# Altium schematic sheet shematic.SchDoc
size A; SheetNumber: 1; SheetTotal: 1; SPICEModelCacheWUGLWVEZ: <root> / <DocumentId>WUGLWVEZ</DocumentId> / <CacheFrame Number="0"> / <Model Name="3mm_151031ss04000" Kind="CKT"> / <Text>************************************************** / * Manufacturer:           Wurth Elektronik / * Kinds:                  THT Mono-color Round Color / * Matchcode:              WL-TMRC / * Library Type:           LTspice / * Version:                rev22a / * Created/modified by:    Ella / * Date and Time:          2022-02-23 / * Team:                   eiSos EDA Service / * Contact:                libraries@we-online.com / ************************************************** / * Copyright(C) 2022 WÃ¼rth Elektronik eiSos GmbH &amp; Co. KG / * All Rights Reserved. / ************************************************** / * Disclaimer: While WÃ¼rth Elektronik eiSos has made every reasonable effort to ensure the accuracy / * of the simulation models provided, WÃ¼rth Elektronik eiSos does not guarantee the exemption of error on / * the simulation models, nor does WÃ¼rth Elektronik eiSos guarantee that the simulation model is current. / * WÃ¼rth Elektronik eiSos reserves the right to make any adjustments at any time without notice. / * WÃ¼rth Elektronik eiSos expressly disclaims all implied warranties regarding this simulation model. / ************************************************** / .subckt 3mm_151031SS04000  1  2 / D1 1 2 TMRC / .MODEL TMRC D / + IS=10.010E-21 / + N=1.8860 / + RS=1.0000E-6 / + IKF=1.0000E3 / + CJO=1.0000E-12 / + M=.3333 / + VJ=.75 / + BV=5 / + IBV=10.00E-6 / + TT=5.0000E-9 / .ends</Text> / </Model> / <Model Name="3mm_151031vs06000" Kind="CKT"> / <Text>****** / .subckt 3mm_151031VS06000  1  2 / D1 1 2 TMRC / .MODEL TMRC D / + IS=10.010E-21 / + N=1.9531 / + RS=1.0000E-6 / + IKF=4.1566E-3 / + CJO=1.0000E-12 / + M=.3333 / + VJ=.75 / + BV=5 / + IBV=10.00E-6 / + TT=5.0000E-9 / .ends</Text> / </Model> / </CacheFrame> / </root>
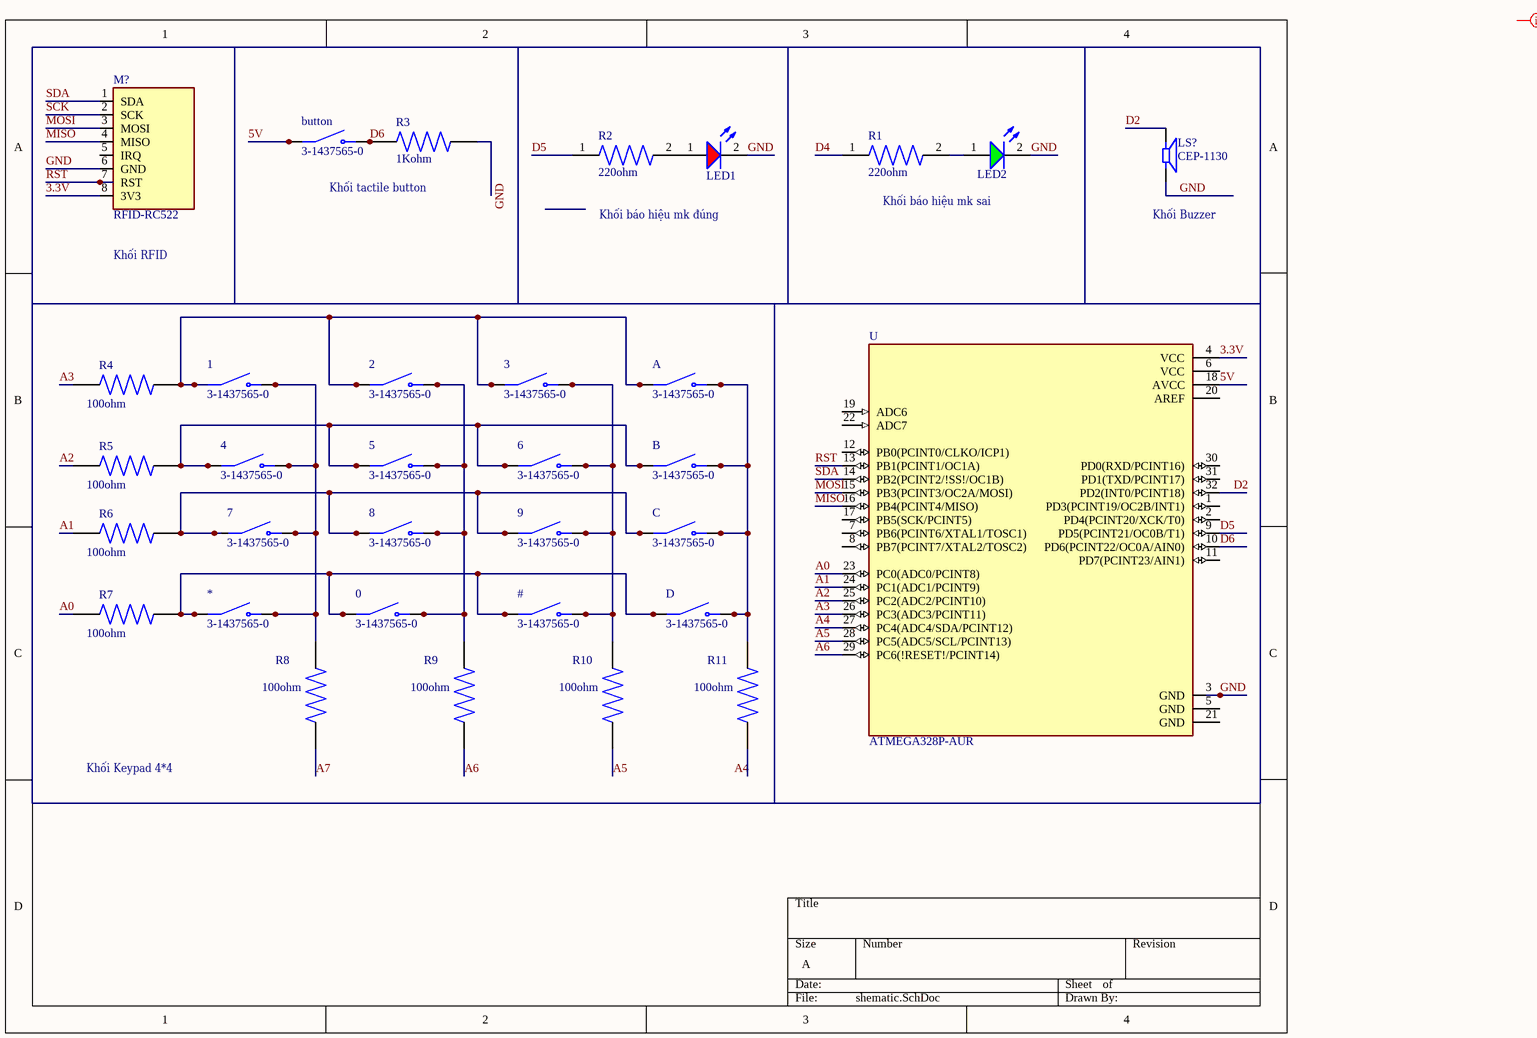
[diagram p0: shematic.SchDoc]

## Parts
0  3-1437565-0  [SW_3-1437565-0]
1  3-1437565-0  [SW_3-1437565-0]
2  3-1437565-0  [SW_3-1437565-0]
3  3-1437565-0  [SW_3-1437565-0]
4  3-1437565-0  [SW_3-1437565-0]
5  3-1437565-0  [SW_3-1437565-0]
6  3-1437565-0  [SW_3-1437565-0]
7  3-1437565-0  [SW_3-1437565-0]
8  3-1437565-0  [SW_3-1437565-0]
9  3-1437565-0  [SW_3-1437565-0]
#  3-1437565-0  [SW_3-1437565-0]
*  3-1437565-0  [SW_3-1437565-0]
A  3-1437565-0  [SW_3-1437565-0]
B  3-1437565-0  [SW_3-1437565-0]
button  3-1437565-0  [SW_3-1437565-0]
C  3-1437565-0  [SW_3-1437565-0]
D  3-1437565-0  [SW_3-1437565-0]
LED1  Super Red, 2V, 40°  [WL-TMRC_D3.95H5.3]  (value not drawn)
LED2  Bright Green, 2.2V, 60°  [WL-TMRC_D3.95H5.3]  (value not drawn)
LS?  CEP-1130  [CUI_CEP-1130]
M?  RFID-RC522  [RFID-RC522]
R1  220ohm  [RESAD700W45L350D185]
R2  220ohm  [RESAD700W45L350D185]
R3  1Kohm  [RESC2012X65N]
R4  100ohm  [RESC1005X35N]
R5  100ohm  [RESC1005X35N]
R6  100ohm  [RESC1005X35N]
R7  100ohm  [RESC1005X35N]
R8  100ohm  [RESC1005X35N]
R9  100ohm  [RESC1005X35N]
R10  100ohm  [RESC1005X35N]
R11  100ohm  [RESC1005X35N]
U  ATMEGA328P-AUR  [QFP80P900X900X120-32N]

## Nets
3.3V: M?.8(3V3) U.4(VCC)
5V: button.1(COM) button.2(COM) U.18(AVCC)
A0: R7.1 U.23(PC0(ADC0/PCINT8))
A1: R6.1 U.24(PC1(ADC1/PCINT9))
A2: R5.1 U.25(PC2(ADC2/PCINT10))
A3: R4.1 U.26(PC3(ADC3/PCINT11))
A4: U.27(PC4(ADC4/SDA/PCINT12))
A5: R10.2 U.28(PC5(ADC5/SCL/PCINT13))
A6: R9.2 U.29(PC6(!RESET!/PCINT14))
A7: R8.1
D2: LS?.1 U.32(PD2(INT0/PCINT18))
D4: R1.1
D5: R2.1 U.9(PD5(PCINT21/OC0B/T1))
D6: button.3(NO) button.4(NO) R3.1 U.10(PD6(PCINT22/OC0A/AIN0))
GND: LED1.2(K) LED2.2(K) LS?.2 M?.6(GND) R3.2 U.3(GND)
MISO: M?.4(MISO) U.16(PB4(PCINT4/MISO))
MOSI: M?.3(MOSI) U.15(PB3(PCINT3/OC2A/MOSI))
RST: M?.7(RST) U.13(PB1(PCINT1/OC1A))
SCK: M?.2(SCK)
SDA: M?.1(SDA) U.14(PB2(PCINT2/!SS!/OC1B))
Net0_1: 0.1(COM) 0.2(COM) #.1(COM) #.2(COM) *.1(COM) *.2(COM) D.1(COM) D.2(COM) R7.2
Net0_3: 0.3(NO) 0.4(NO) 2.3(NO) 2.4(NO) 5.3(NO) 5.4(NO) 8.3(NO) 8.4(NO) R9.1
Net1_1: 1.1(COM) 1.2(COM) 2.1(COM) 2.2(COM) 3.1(COM) 3.2(COM) A.1(COM) A.2(COM) R4.2
Net1_3: 1.3(NO) 1.4(NO) 4.3(NO) 4.4(NO) 7.3(NO) 7.4(NO) *.3(NO) *.4(NO) R8.2
Net3_3: 3.3(NO) 3.4(NO) 6.3(NO) 6.4(NO) 9.3(NO) 9.4(NO) #.3(NO) #.4(NO) R10.1
Net4_1: 4.1(COM) 4.2(COM) 5.1(COM) 5.2(COM) 6.1(COM) 6.2(COM) B.1(COM) B.2(COM) R5.2
Net7_1: 7.1(COM) 7.2(COM) 8.1(COM) 8.2(COM) 9.1(COM) 9.2(COM) C.1(COM) C.2(COM) R6.2
NetA_3: A.3(NO) A.4(NO) B.3(NO) B.4(NO) C.3(NO) C.4(NO) D.3(NO) D.4(NO) R11.1
NetLED1_1: LED1.1(A) R2.2
NetLED2_1: LED2.1(A) R1.2

Not connected (* = marked no-connect by the designer): M? 5(IRQ); R11 2; U 1(PD3(PCINT19/OC2B/INT1)) 2(PD4(PCINT20/XCK/T0)) 5(GND) 6(VCC) 7(PB6(PCINT6/XTAL1/TOSC1)) 8(PB7(PCINT7/XTAL2/TOSC2)) 11(PD7(PCINT23/AIN1)) 12(PB0(PCINT0/CLKO/ICP1)) 17(PB5(SCK/PCINT5)) 19(ADC6) 20(AREF) 21(GND) 22(ADC7) 30(PD0(RXD/PCINT16)) 31(PD1(TXD/PCINT17))

## Notes on the sheet
- Khối tactile button
- Khối báo hiệu mk đúng
- Khối báo hiệu mk sai
- (near LS?) Khối Buzzer
- Khối RFID
- Khối Keypad 4*4
- Labels drawn without touching a wire or pin: A4

## Library data of the parts
0-9 # * A B button C D = 3-1437565-0: Switch Tactile OFF (ON) SPST Round Button Gull Wing 0.05A 24VDC 1VA 9.18N SMD T/R; MF: TE Connectivity; MP: 3-1437565-0; Package: SMD-6 Omron Electronics; Purchase-URL: https://pricing.snapeda.com/search/part/3-1437565-0/?ref=eda; Price: None; Value: *; SnapEDA_Link: https://www.snapeda.com/parts/3-1437565-0/TE%20Connectivity/view-part/294084/?ref=snap; Availability: Good
LED1 = 151031SS04000: WL-TMRC Mono-color Round Color, THT, D3.95 x H5.3mm, Super Red, 2V, 40°; Manufacturer: Wurth Elektronik; Case/Size Code: 3mm; Chip Technology: AlInGaP; Dominant Wavelength: 635nm; Luminous Intensity: 160mcd; Peak Wavelength: 640nm; Manufacturer Part Number: 151031SS04000; Category: Signal LEDs; Match Code: WL-TMRC; ComponentLink1Description: Website Link; ComponentLink1URL: https://www.we-online.com/redexpert/article/151031SS04000?ad; ComponentLink2Description: Datasheet Link; ComponentLink2URL: https://www.we-online.com/redexpert/spec/151031SS04000?ad; Mount: Through Hole; Operating Temperature Max: 85°C; Operating Temperature Min: -40°C; Packaging: Bulk; Height: 5.3mm; Diameter: 3.95mm; Emitting Color: Super Red; Forward Voltage: 2V; Viewing Angle: 40°
LED2 = 151031VS06000: WL-TMRC Mono-color Round Color, THT, D3.95 x H5.3mm, Bright Green, 2.2V, 60°; Manufacturer: Wurth Elektronik; Case/Size Code: 3mm; Chip Technology: GaAsP/GaP; Dominant Wavelength: 568nm; Luminous Intensity: 30mcd; Peak Wavelength: 560nm; Manufacturer Part Number: 151031VS06000; Category: Signal LEDs; Match Code: WL-TMRC; ComponentLink1Description: Website Link; ComponentLink1URL: https://www.we-online.com/redexpert/article/151031VS06000?ad; ComponentLink2Description: Datasheet Link; ComponentLink2URL: https://www.we-online.com/redexpert/spec/151031VS06000?ad; Mount: Through Hole; Operating Temperature Max: 85°C; Operating Temperature Min: -40°C; Packaging: Bulk; Height: 5.3mm; Diameter: 3.95mm; Emitting Color: Bright Green; Forward Voltage: 2.2V; Viewing Angle: 60°
LS? = CEP-1130: 30.2 mm, 30 V, 90 dB, Through Hole, Piezo Audio Transducer Buzzer; MP: CEP-1130; Availability: Unavailable; Value: *; Price: None; Package: None
M? = RFID-RC522: Bá»™ cÃ´ng cá»¥ phÃ¡t triá»ƒn trong IC Ä‘áº§u Ä‘á»c/ghi tÃ­ch há»£p MFRC522 Ä‘á»ƒ liÃªn láº¡c khÃ´ng tiáº¿p xÃºc á»Ÿ táº§n sá»‘ 13,56 MHz.; MF: Handson Technology; SnapEDA_Link: https://www.snapeda.com/parts/RFID-RC522/Handson+Technology/view-part/?ref=snap; Package: Package; Value: *; MP: RFID-RC522; Check_prices: https://www.snapeda.com/parts/RFID-RC522/Handson+Technology/view-part/?ref=eda
R1 R2 = 4-1623927-9: Through Hole Carbon Film Resistor, Cfr Series, 220 Ohm, 250 Mw, - 5%, 200 V, Axial Leaded; MF: TE Connectivity; Package: None; MP: 4-1623927-9; Value: *; Availability: Warning; Price: None; EU_RoHS_Compliance: Compliant; SnapEDA_Link: https://www.snapeda.com/parts/4-1623927-9/TE%20Connectivity/view-part/2381393/?ref=snap
R3 = CPF0805B1K0E: CPF0805 1K0 0.1% 25PPM 5K RL; Tolerance: .1%; Power_Rating: .1 W; MF: TE Connectivity; Voltage_Rating: 100 V; Resistance: 1K; MP: CPF0805B1K0E; EU_RoHS_Compliance: Compliant; Availability: Unavailable; SnapEDA_Link: https://www.snapeda.com/parts/CPF0805B1K0E/TE%20Connectivity/view-part/2531918/?ref=snap; TE_purchase_URL: https://www.te.com/usa-en/product-1614902-2.html?te_bu=Cor&te_type=disp&te_campaign=seda_glo_cor-seda-global-disp-prtnr-fy19-seda-model-bom-cta_sma-317_1&elqCampaignId=32493; Package: 0805; Price: None; Value: *
R4-R11 = CPF0402B100RE1: CPF 0402 100R 0.1% 25PPM 1K RL; Package: None; Price: None; Value: *; MP: CPF0402B100RE1; Availability: Unavailable
U = ATMEGA328P-AUR: AVR AVRÂ® ATmega Microcontroller IC 8-Bit 20MHz 32KB _16K x 16_ FLASH 32-TQFP _7x7_; MF: Microchip; Package: TQFP-32 Microchip; Digi-Key_Part_Number: ATMEGA328P-AURCT-ND; Digi-Key_Purchase_URL: https://www.digikey.com/product-detail/en/microchip-technology/ATMEGA328P-AUR/ATMEGA328P-AURCT-ND/3789455?utm_source=snapeda&utm_medium=aggregator&utm_campaign=symbol; Value: *; MP: ATMEGA328P-AUR; SnapEDA_Link: https://www.snapeda.com/parts/ATMEGA328P-AUR/Microchip/view-part/1212624/?ref=snap